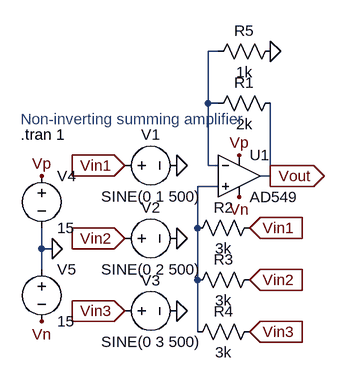
[diagram p0: schematic sch.asc]
sch.asc, the LTspice schematic file:
Version 4
SHEET 1 880 680
WIRE 192 -32 176 -32
WIRE 176 48 176 -32
WIRE 192 48 176 48
WIRE 176 144 176 48
WIRE 192 144 176 144
WIRE 272 160 272 48
WIRE 272 160 256 160
WIRE 192 176 160 176
WIRE 160 240 160 176
WIRE -80 272 -80 240
WIRE -64 272 -80 272
WIRE -80 304 -80 272
WIRE 160 320 160 240
WIRE 160 400 160 320
FLAG 272 -32 0
FLAG -64 272 0
FLAG 128 144 0
FLAG 128 256 0
FLAG 128 368 0
FLAG 48 144 Vin1
IOPIN 48 144 In
FLAG 240 240 Vin1
IOPIN 240 240 In
FLAG 48 256 Vin2
IOPIN 48 256 In
FLAG 240 320 Vin2
IOPIN 240 320 In
FLAG 48 368 Vin3
IOPIN 48 368 In
FLAG 240 400 Vin3
IOPIN 240 400 In
FLAG 272 160 Vout
IOPIN 272 160 Out
FLAG -80 160 Vp
FLAG 224 128 Vp
FLAG -80 384 Vn
FLAG 224 192 Vn
SYMBOL OpAmps\\AD549 224 96 R0
SYMATTR InstName U1
SYMBOL res 288 32 R90
WINDOW 0 0 56 VBottom 2
WINDOW 3 32 56 VTop 2
SYMATTR InstName R1
SYMATTR Value 2k
SYMBOL res 256 224 R90
WINDOW 0 0 56 VBottom 2
WINDOW 3 32 56 VTop 2
SYMATTR InstName R2
SYMATTR Value 3k
SYMBOL res 256 304 R90
WINDOW 0 0 56 VBottom 2
WINDOW 3 32 56 VTop 2
SYMATTR InstName R3
SYMATTR Value 3k
SYMBOL res 256 384 R90
WINDOW 0 0 56 VBottom 2
WINDOW 3 32 56 VTop 2
SYMATTR InstName R4
SYMATTR Value 3k
SYMBOL voltage 32 144 R270
WINDOW 0 32 56 VTop 2
WINDOW 3 -32 56 VBottom 2
WINDOW 123 0 0 Left 0
WINDOW 39 0 0 Left 0
SYMATTR InstName V1
SYMATTR Value SINE(0 1 500)
SYMBOL voltage 32 256 R270
WINDOW 0 32 56 VTop 2
WINDOW 3 -32 56 VBottom 2
WINDOW 123 0 0 Left 0
WINDOW 39 0 0 Left 0
SYMATTR InstName V2
SYMATTR Value SINE(0 2 500)
SYMBOL voltage 32 368 R270
WINDOW 0 32 56 VTop 2
WINDOW 3 -32 56 VBottom 2
WINDOW 123 0 0 Left 0
WINDOW 39 0 0 Left 0
SYMATTR InstName V3
SYMATTR Value SINE(0 3 500)
SYMBOL voltage -80 144 R0
WINDOW 123 0 0 Left 0
WINDOW 39 0 0 Left 0
SYMATTR InstName V4
SYMATTR Value 15
SYMBOL voltage -80 288 R0
WINDOW 123 0 0 Left 0
WINDOW 39 0 0 Left 0
SYMATTR InstName V5
SYMATTR Value 15
SYMBOL res 288 -48 R90
WINDOW 0 0 56 VBottom 2
WINDOW 3 32 56 VTop 2
SYMATTR InstName R5
SYMATTR Value 1k
TEXT -112 72 Left 2 ;Non-inverting summing amplifier
TEXT -112 96 Left 2 !.tran 1

The netlist it stands for:
* sch.asc
XU1 N002 N001 Vp Vn Vout AD549  ; pins In+ In- V+ V- OUT
R1 Vout N001 2k
R2 Vin1 N002 3k
R3 Vin2 N002 3k
R4 Vin3 N002 3k
V1 Vin1 0 SINE(0 1 500)
V2 Vin2 0 SINE(0 2 500)
V3 Vin3 0 SINE(0 3 500)
V4 Vp 0 15
V5 0 Vn 15
R5 0 N001 1k
* Non-inverting summing amplifier
.tran 1
.backanno
.end